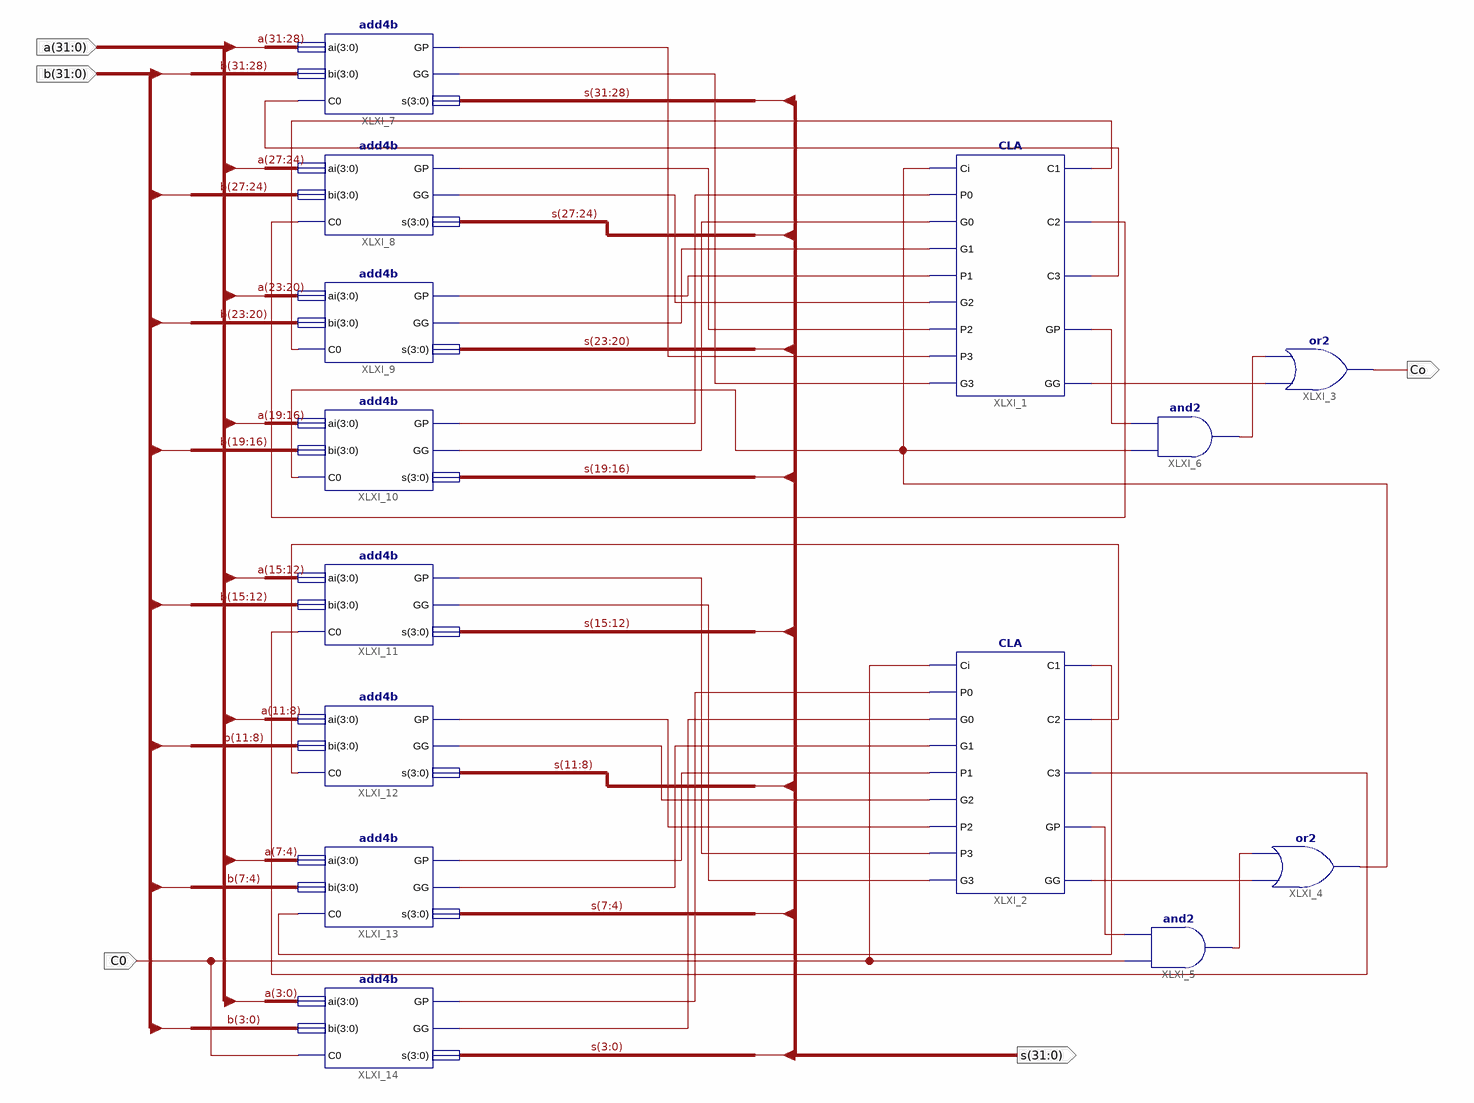
[diagram p0: schematic sheet 1]
// Xilinx ISE schematic ADC32.sch (kintex7) as structural Verilog: 14 symbols, 5 ports
module ADC32 (
  input  C0,
  input  [31:0] a,
  input  [31:0] b,
  output Co,
  output [31:0] s
);

  wire XLXN_3, XLXN_4, XLXN_5, XLXN_6, XLXN_7, XLXN_8, XLXN_29, XLXN_30, XLXN_31, XLXN_32, XLXN_33, XLXN_34,
       XLXN_35, XLXN_36, XLXN_37, XLXN_38, XLXN_40, XLXN_41, XLXN_42, XLXN_43, XLXN_44, XLXN_45, XLXN_46,
       XLXN_47, XLXN_48, XLXN_50, XLXN_51, XLXN_52, XLXN_53;

  CLA XLXI_1 (
    .Ci(XLXN_50), .P0(XLXN_37), .G0(XLXN_38), .G1(XLXN_41), .P1(XLXN_40), .G2(XLXN_42), .P2(XLXN_43),
    .P3(XLXN_45), .G3(XLXN_44), .C1(XLXN_48), .C2(XLXN_47), .C3(XLXN_46), .GP(XLXN_5), .GG(XLXN_4));
  CLA XLXI_2 (
    .Ci(C0), .P0(XLXN_29), .G0(XLXN_30), .G1(XLXN_32), .P1(XLXN_31), .G2(XLXN_34), .P2(XLXN_33),
    .P3(XLXN_35), .G3(XLXN_36), .C1(XLXN_53), .C2(XLXN_52), .C3(XLXN_51), .GP(XLXN_7), .GG(XLXN_3));
  or XLXI_3 (Co, XLXN_4, XLXN_6);
  or XLXI_4 (XLXN_50, XLXN_3, XLXN_8);
  and XLXI_5 (XLXN_8, C0, XLXN_7);
  and XLXI_6 (XLXN_6, XLXN_50, XLXN_5);
  add4b XLXI_7 (.ai(a[31:28]), .bi(b[31:28]), .C0(XLXN_46), .GP(XLXN_45), .GG(XLXN_44), .s(s[31:28]));
  add4b XLXI_8 (.ai(a[27:24]), .bi(b[27:24]), .C0(XLXN_47), .GP(XLXN_43), .GG(XLXN_42), .s(s[27:24]));
  add4b XLXI_9 (.ai(a[23:20]), .bi(b[23:20]), .C0(XLXN_48), .GP(XLXN_40), .GG(XLXN_41), .s(s[23:20]));
  add4b XLXI_10 (.ai(a[19:16]), .bi(b[19:16]), .C0(XLXN_50), .GP(XLXN_37), .GG(XLXN_38), .s(s[19:16]));
  add4b XLXI_11 (.ai(a[15:12]), .bi(b[15:12]), .C0(XLXN_51), .GP(XLXN_35), .GG(XLXN_36), .s(s[15:12]));
  add4b XLXI_12 (.ai(a[11:8]), .bi(b[11:8]), .C0(XLXN_52), .GP(XLXN_33), .GG(XLXN_34), .s(s[11:8]));
  add4b XLXI_13 (.ai(a[7:4]), .bi(b[7:4]), .C0(XLXN_53), .GP(XLXN_31), .GG(XLXN_32), .s(s[7:4]));
  add4b XLXI_14 (.ai(a[3:0]), .bi(b[3:0]), .C0(C0), .GP(XLXN_29), .GG(XLXN_30), .s(s[3:0]));
endmodule
